# EAGLE design Analog_Shield (EAGLE 6.4)
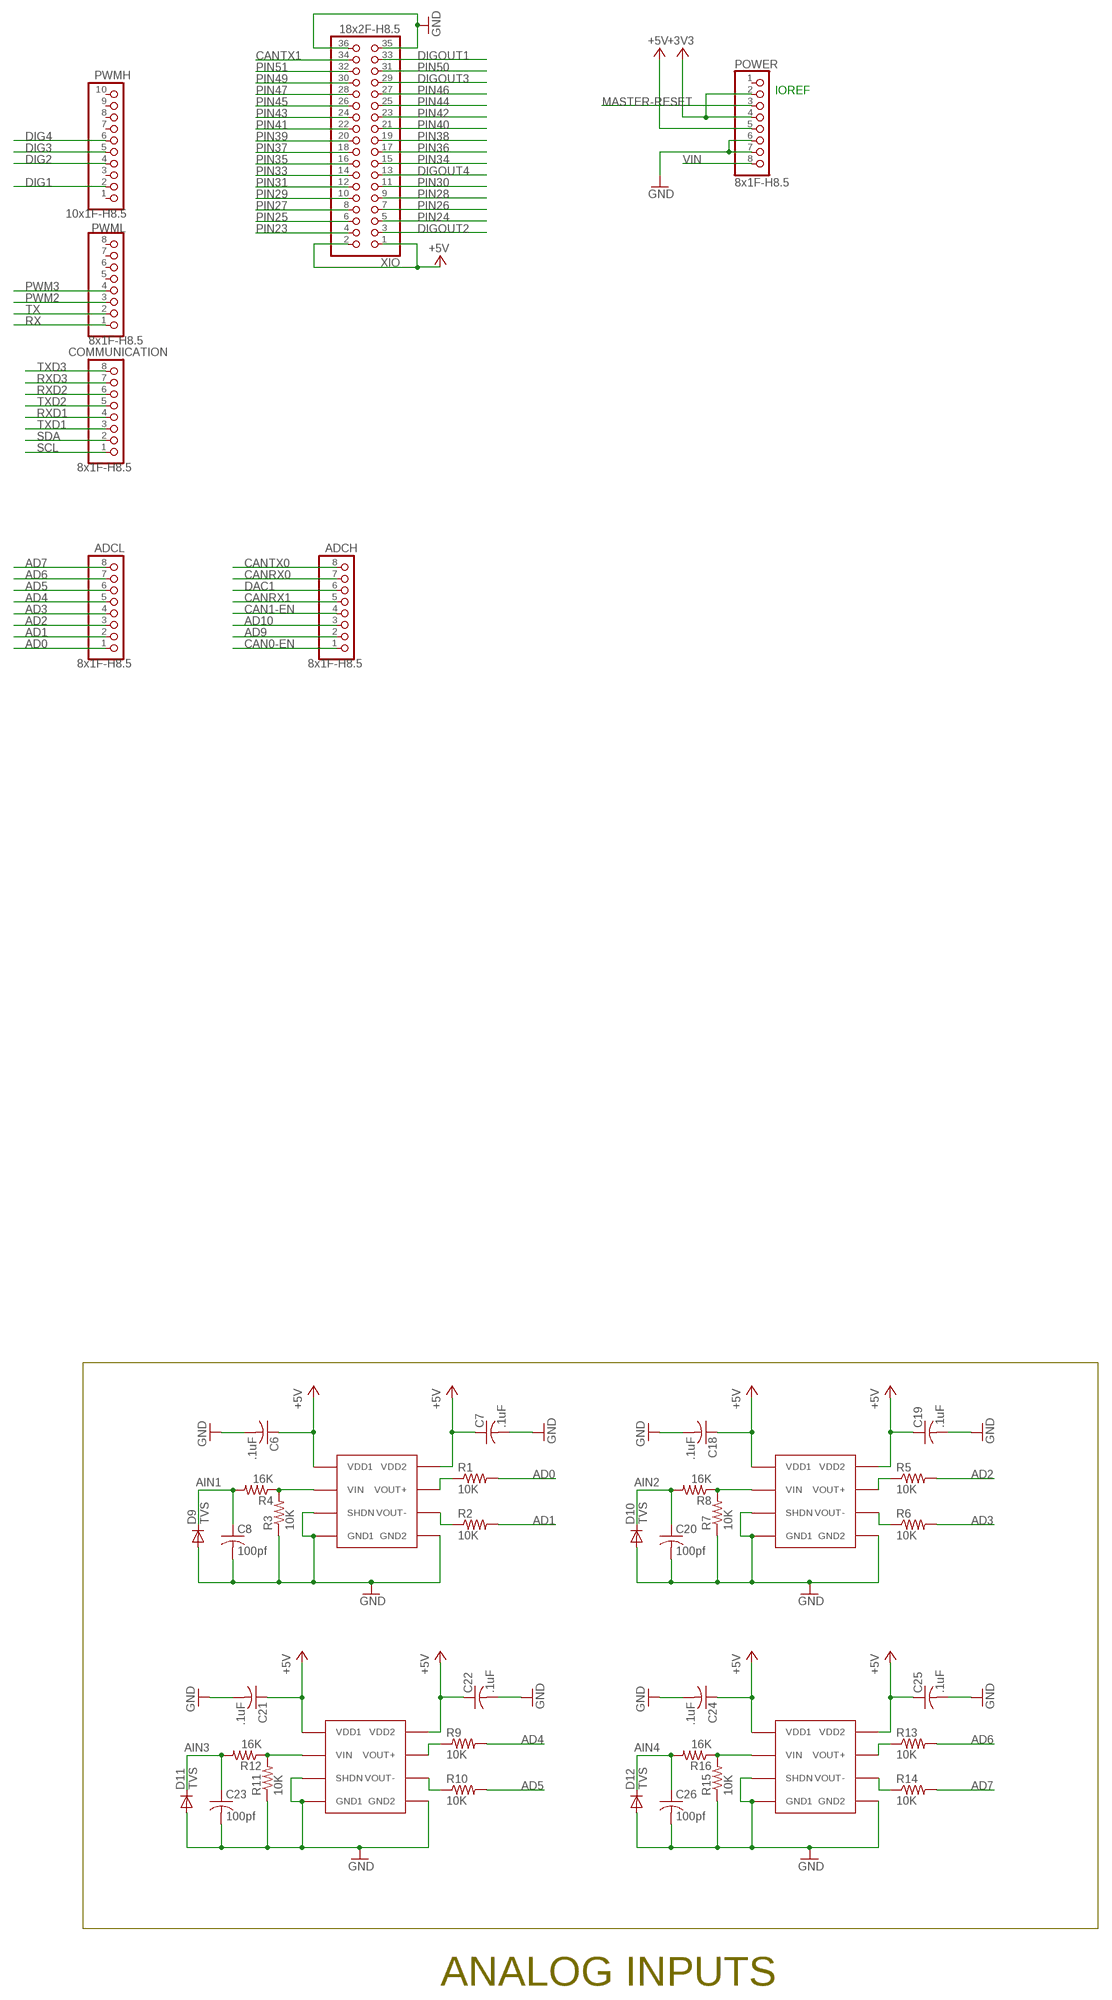
[diagram p0: schematic, sheet 1]

## Parts
ADCH  8x1F-H8.5  PINHD-1X8  [1X08]
ADCL  8x1F-H8.5  PINHD-1X8  [1X08]
C6  .1uF  C-USC0603  [C0603]
C7  .1uF  C-USC0603  [C0603]
C8  100pf  C-USC0603  [C0603]
C18  .1uF  C-USC0603  [C0603]
C19  .1uF  C-USC0603  [C0603]
C20  100pf  C-USC0603  [C0603]
C21  .1uF  C-USC0603  [C0603]
C22  .1uF  C-USC0603  [C0603]
C23  100pf  C-USC0603  [C0603]
C24  .1uF  C-USC0603  [C0603]
C25  .1uF  C-USC0603  [C0603]
C26  100pf  C-USC0603  [C0603]
COMMUNICATION  8x1F-H8.5  PINHD-1X8  [1X08]
D9  TVS  DIODESOD  [SOD-323]
D10  TVS  DIODESOD  [SOD-323]
D11  TVS  DIODESOD  [SOD-323]
D12  TVS  DIODESOD  [SOD-323]
POWER  8x1F-H8.5  PINHD-1X8  [1X08]
PWMH  10x1F-H8.5  PINHD-1X10  [1X10]
PWML  8x1F-H8.5  PINHD-1X8  [1X08]
R1  10K  R-US_R0603  [R0603]
R2  10K  R-US_R0603  [R0603]
R3  10K  R-US_R0603  [R0603]
R4  16K  R-US_R0603  [R0603]
R5  10K  R-US_R0603  [R0603]
R6  10K  R-US_R0603  [R0603]
R7  10K  R-US_R0603  [R0603]
R8  16K  R-US_R0603  [R0603]
R9  10K  R-US_R0603  [R0603]
R10  10K  R-US_R0603  [R0603]
R11  10K  R-US_R0603  [R0603]
R12  16K  R-US_R0603  [R0603]
R13  10K  R-US_R0603  [R0603]
R14  10K  R-US_R0603  [R0603]
R15  10K  R-US_R0603  [R0603]
R16  16K  R-US_R0603  [R0603]
U$1  ACPL-C87A-000E  [SO8-WIDE]
U$10  ACPL-C87A-000E  [SO8-WIDE]
U$11  ACPL-C87A-000E  [SO8-WIDE]
U$12  ACPL-C87A-000E  [SO8-WIDE]
XIO  18x2F-H8.5  PINHD-2X18  [2X18]

## Nets
+3V3: POWER.2 POWER.4
+5V: C6.1 C7.1 C18.1 C19.1 C21.1 C22.1 C24.1 C25.1 POWER.5 U$1.1(VDD1) U$1.8(VDD2) U$10.1(VDD1) U$10.8(VDD2) U$11.1(VDD1) U$11.8(VDD2) U$12.1(VDD1) U$12.8(VDD2) XIO.1 XIO.2
AD0: ADCL.1 R1.2
AD1: ADCL.2 R2.2
AD2: ADCL.3 R5.2
AD3: ADCL.4 R6.2
AD4: ADCL.5 R9.2
AD5: ADCL.6 R10.2
AD6: ADCL.7 R13.2
AD7: ADCL.8 R14.2
AD9: ADCH.2
AD10: ADCH.3
AIN1: C8.1 D9.1(C) R4.2
AIN2: C20.1 D10.1(C) R8.2
AIN3: C23.1 D11.1(C) R12.2
AIN4: C26.1 D12.1(C) R16.2
CAN0-EN: ADCH.1
CAN1-EN: ADCH.4
CANRX0: ADCH.7
CANRX1: ADCH.5
CANTX0: ADCH.8
CANTX1: XIO.34
DAC1: ADCH.6
DIG1: PWMH.2
DIG2: PWMH.4
DIG3: PWMH.5
DIG4: PWMH.6
DIGOUT1: XIO.33
DIGOUT2: XIO.3
DIGOUT3: XIO.29
DIGOUT4: XIO.13
GND: C6.2 C7.2 C8.2 C18.2 C19.2 C20.2 C21.2 C22.2 C23.2 C24.2 C25.2 C26.2 D9.2(A) D10.2(A) D11.2(A) D12.2(A) POWER.6 POWER.7 R3.1 R7.1 R11.1 R15.1 U$1.3(SHDN) U$1.4(GND1) U$1.5(GND2) U$10.3(SHDN) U$10.4(GND1) U$10.5(GND2) U$11.3(SHDN) U$11.4(GND1) U$11.5(GND2) U$12.3(SHDN) U$12.4(GND1) U$12.5(GND2) XIO.35 XIO.36
MASTER-RESET: POWER.3
N$5: R1.1 U$1.7(VOUT+)
N$7: R2.1 U$1.6(VOUT-)
N$10: R3.2 R4.1 U$1.2(VIN)
N$11: R7.2 R8.1 U$10.2(VIN)
N$12: R5.1 U$10.7(VOUT+)
N$13: R6.1 U$10.6(VOUT-)
N$15: R11.2 R12.1 U$11.2(VIN)
N$16: R9.1 U$11.7(VOUT+)
N$17: R10.1 U$11.6(VOUT-)
N$19: R15.2 R16.1 U$12.2(VIN)
N$20: R13.1 U$12.7(VOUT+)
N$21: R14.1 U$12.6(VOUT-)
PIN23: XIO.4
PIN24: XIO.5
PIN25: XIO.6
PIN26: XIO.7
PIN27: XIO.8
PIN28: XIO.9
PIN29: XIO.10
PIN30: XIO.11
PIN31: XIO.12
PIN33: XIO.14
PIN34: XIO.15
PIN35: XIO.16
PIN36: XIO.17
PIN37: XIO.18
PIN38: XIO.19
PIN39: XIO.20
PIN40: XIO.21
PIN41: XIO.22
PIN42: XIO.23
PIN43: XIO.24
PIN44: XIO.25
PIN45: XIO.26
PIN46: XIO.27
PIN47: XIO.28
PIN49: XIO.30
PIN50: XIO.31
PIN51: XIO.32
PWM2: PWML.3
PWM3: PWML.4
RX: PWML.1
RXD1: COMMUNICATION.4
RXD2: COMMUNICATION.6
RXD3: COMMUNICATION.7
SCL: COMMUNICATION.1
SDA: COMMUNICATION.2
TX: PWML.2
TXD1: COMMUNICATION.3
TXD2: COMMUNICATION.5
TXD3: COMMUNICATION.8
VIN: POWER.8
Unconnected: POWER.1 PWMH.1 PWMH.3 PWMH.7 PWMH.8 PWMH.9 PWMH.10 PWML.5 PWML.6 PWML.7 PWML.8

## Notes on the sheet
- IOREF
- ANALOG INPUTS

## Library data of the parts
ADCH ADCL COMMUNICATION POWER PWML = SmartPrj:PINHD-1X8: PIN HEADER
C6-C8 C18-C26 = rcl:C-US: CAPACITOR, American symbol
D9-D12 = SparkFun-DiscreteSemi:DIODE: Diode These are standard reverse protection diodes and small signal diodes. SMA package can handle up to about 1A. SOD-323 can handle about 200mA. What the SOD-323 package when ordering, there are some mfgs out there that are 5-pin packages.
PWMH = SmartPrj:PINHD-1X10: PIN HEADER
R1-R16 = rcl:R-US_: RESISTOR, American symbol
U$1 U$10-U$12 = ck_custom:ACPL-C87A-000E
XIO = SmartPrj:PINHD-2X18: PIN HEADER

## Net classes
0 default: width 0.203 mm, drill 0.305 mm, clearance 0.203 mm
1 USB: drill 0.406 mm, clearance 0.203 mm to class 0, clearance 0.406 mm
2 gnd: width 0.305 mm, drill 0.406 mm, clearance 0.203 mm to class 0, clearance 0.203 mm
3 usbvcc: width 0.61 mm, drill 0.508 mm, clearance 0.203 mm to class 0, clearance 0.254 mm

## Board
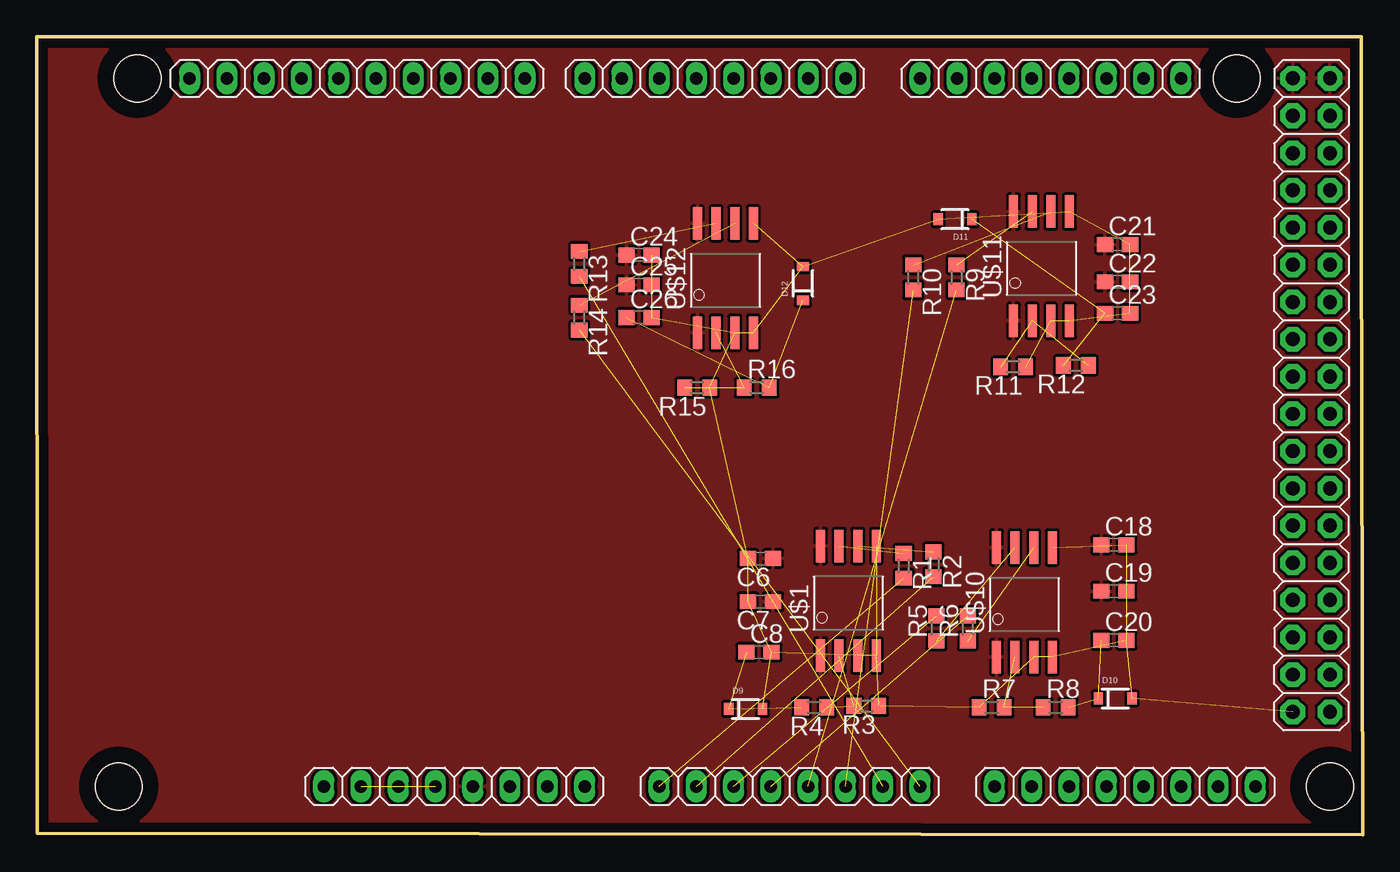
[diagram p1: board, top side]
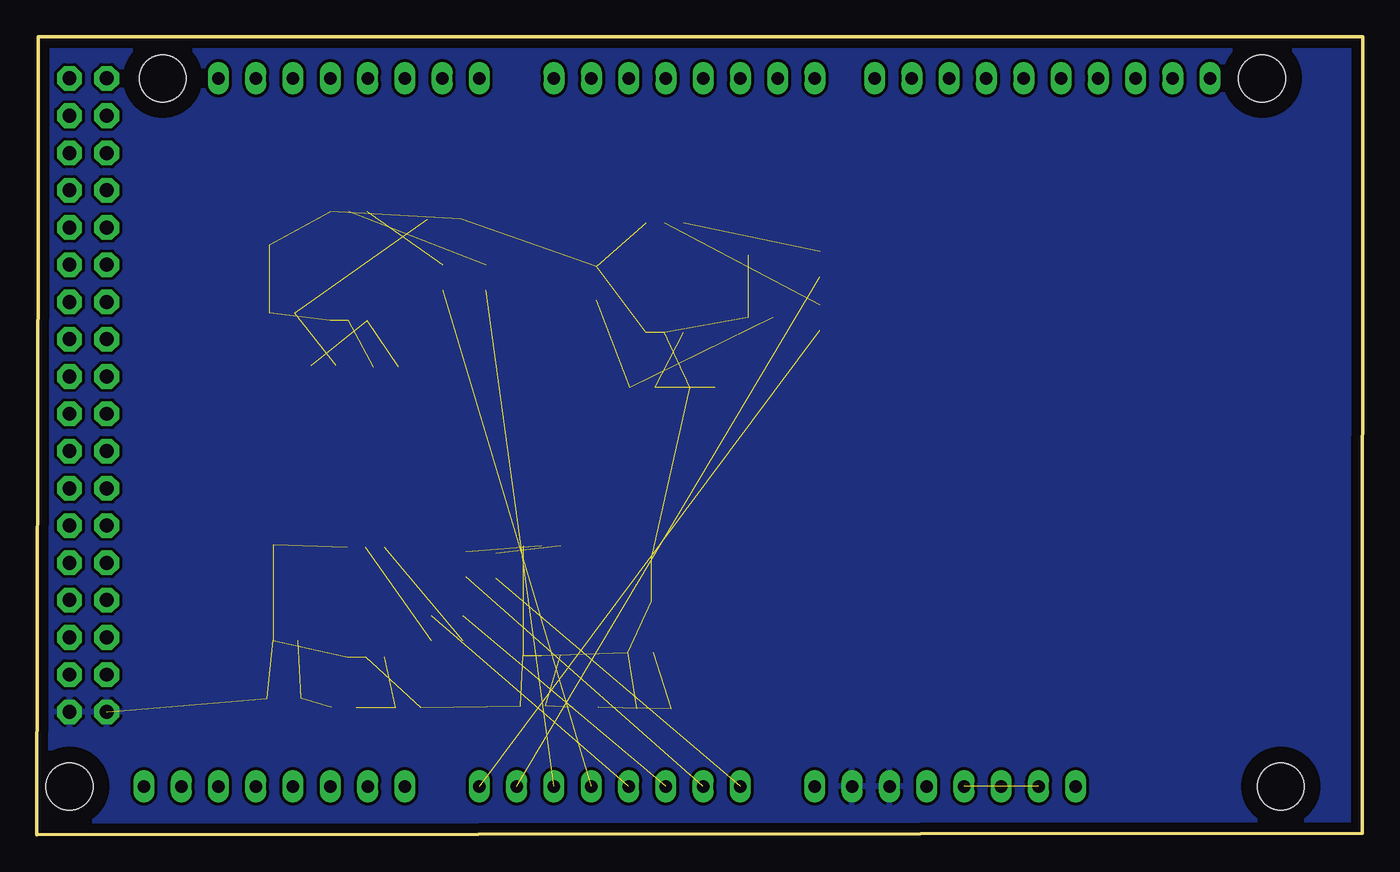
[diagram p2: board, bottom side, seen from below]

Size 90.37 x 54.41 mm. Coordinates in mm from the lower left corner, seen from the top.
Outline: 90.27,42.16 90.37,0 0.05,0.1 0,54.41 90.27,54.41 90.27,42.22
Copper layers (1*16): Top 0.035mm / dielectric 0.2mm / Bottom 0.035mm
Design rules "default *": minimum track width 8mil, minimum drill 16mil, track to track 8mil, track to pad 8mil, pad to pad 6mil, via to via 8mil, smd to smd 6mil, copper to edge 25mil, drill to drill 12mil, minimum pad ring 8mil, minimum via ring 8mil, stop-mask expansion 2mil, vias tented up to drill 25mil, thermal gap 8mil
Holes 3.2 mm at 88.14,3.3 6.86,51.56 81.79,51.56 5.59,3.3
tRestrict: area 4.3,49 to 9.4,54.1; area 79.2,49 to 84.3,54.1; area 85.6,0.8 to 90.7,5.8; area 3,0.8 to 8.1,5.8
bRestrict: area 4.3,49 to 9.4,54.1; area 79.2,49 to 84.3,54.1; area 85.6,0.8 to 90.7,5.8; area 3,0.8 to 8.1,5.8

### Footprints (pad centres in the part's own frame; a part is rotated, then mirrored left to right if it is on the bottom)
1X08 = drill 0.85 pad 1.422 long: 1 -8.89,0; 2 -6.35,0; 3 -3.81,0; 4 -1.27,0; 5 1.27,0; 6 3.81,0; 7 6.35,0; 8 8.89,0
C0603 = smd 1.1 x 1: 1 -0.85,0; 2 0.85,0
SOD-323 = smd 0.63 x 0.83: 1 -1.15,0; 2 1.15,0
1X10 = drill 0.85 pad 1.422 long: 1 -11.43,0; 2 -8.89,0; 3 -6.35,0; 4 -3.81,0; 5 -1.27,0; 6 1.27,0; 7 3.81,0; 8 6.35,0; 9 8.89,0; 10 11.43,0
R0603 = smd 1 x 1.1: 1 -0.85,0; 2 0.85,0
SO8-WIDE = smd 0.61 x 2.21: 1 0.635,-1.029; 2 1.905,-1.029; 3 3.175,-1.029; 4 4.445,-1.029; 5 4.445,6.426; 6 3.175,6.426; 7 1.905,6.426; 8 0.635,6.426
2X18 = drill 0.95 pad 1.676 octagon: 1 -21.59,-1.27; 2 -21.59,1.27; 3 -19.05,-1.27; 4 -19.05,1.27; 5 -16.51,-1.27; 6 -16.51,1.27; 7 -13.97,-1.27; 8 -13.97,1.27; 9 -11.43,-1.27; 10 -11.43,1.27; 11 -8.89,-1.27; 12 -8.89,1.27; 13 -6.35,-1.27; 14 -6.35,1.27; 15 -3.81,-1.27; 16 -3.81,1.27; 17 -1.27,-1.27; 18 -1.27,1.27; 19 1.27,-1.27; 20 1.27,1.27; 21 3.81,-1.27; 22 3.81,1.27; 23 6.35,-1.27; 24 6.35,1.27; 25 8.89,-1.27; 26 8.89,1.27; 27 11.43,-1.27; 28 11.43,1.27; 29 13.97,-1.27; 30 13.97,1.27; 31 16.51,-1.27; 32 16.51,1.27; 33 19.05,-1.27; 34 19.05,1.27; 35 21.59,-1.27; 36 21.59,1.27

### Placement (x,y rotation side)
ADCH  74.17,3.3 0 top
ADCL  51.31,3.3 0 top
C6  49.33,18.85 180 top
C7  49.33,15.9 180 top
C8  49.23,12.45 0 top
C18  73.41,19.76 0 top
C19  73.41,16.61 0 top
C20  73.41,13.26 0 top
C21  73.66,40.23 0 top
C22  73.66,37.69 0 top
C23  73.66,35.56 0 top
C24  41.05,39.52 0 top
C25  41.05,37.49 0 top
C26  41.05,35.26 0 top
COMMUNICATION  69.09,51.56 0 top
D9  48.31,8.59 0 top
D10  73.51,9.3 0 top
D11  62.59,41.96 180 top
D12  52.22,37.59 90 top
POWER  28.45,3.3 0 top
PWMH  21.84,51.56 180 top
PWML  46.23,51.56 180 top
R1  59.08,18.34 270 top
R2  61.11,18.44 270 top
R3  56.54,8.79 180 top
R4  52.98,8.69 180 top
R5  61.32,14.07 90 top
R6  63.45,14.07 90 top
R7  65.07,8.69 0 top
R8  69.44,8.69 0 top
R9  62.69,38 270 top
R10  59.74,38 270 top
R11  66.55,31.9 180 top
R12  70.82,32 180 top
R13  36.98,38.91 270 top
R14  36.98,35.26 270 top
R15  45.01,30.48 180 top
R16  49.07,30.48 0 top
U$1  52.78,13.26 0 top
U$10  64.77,13.16 0 top
U$11  65.94,36.07 0 top
U$12  44.4,35.26 0 top
XIO  86.87,29.97 270 top

### Tracks (layer width: path | path; a pad name or v marks a point on that pad's centre or on a via)
+3V3  (1 unrouted)
+5V
  pour Top: 0.41,54 0.56,0.61 89.87,0.61 89.87,54.1
AD0  (1 unrouted)
AD1  (1 unrouted)
AD2  (1 unrouted)
AD3  (1 unrouted)
AD4  (1 unrouted)
AD5  (1 unrouted)
AD6  (1 unrouted)
AD7  (1 unrouted)
AIN1  (2 unrouted)
AIN2  (2 unrouted)
AIN3  (2 unrouted)
AIN4  (2 unrouted)
GND  (32 unrouted)
  pour Bottom: 0.41,54 89.87,54.1 89.87,0.61 0.56,0.61
N$5  (1 unrouted)
N$7  (1 unrouted)
N$10  (2 unrouted)
N$11  (2 unrouted)
N$12  (1 unrouted)
N$13  (1 unrouted)
N$15  (2 unrouted)
N$16  (1 unrouted)
N$17  (1 unrouted)
N$19  (2 unrouted)
N$20  (1 unrouted)
N$21  (1 unrouted)